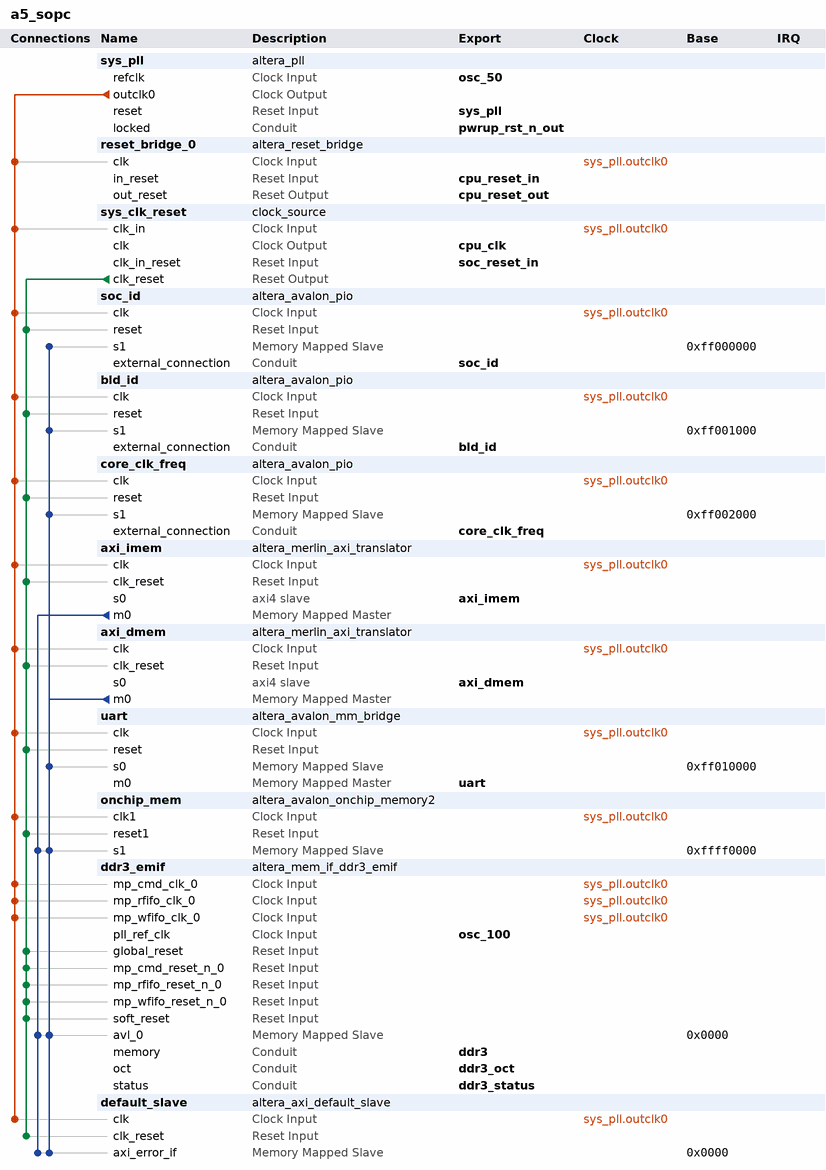
[diagram p0: system contents]
# Platform Designer (Qsys) system a5_sopc, Arria V 5AGXFB3H4F35C4
# Parameters at their usual value, and those the tool derives, are not listed.
package require -exact qsys 13.0
create_system a5_sopc
set_project_property DEVICE_FAMILY {Arria V}
set_project_property DEVICE 5AGXFB3H4F35C4

add_instance sys_pll altera_pll 13.0
set_instance_parameter_value sys_pll gui_device_speed_grade 3_H4
set_instance_parameter_value sys_pll gui_pll_mode {Integer-N PLL}
set_instance_parameter_value sys_pll gui_reference_clock_frequency 50.0
set_instance_parameter_value sys_pll gui_operation_mode normal
set_instance_parameter_value sys_pll gui_use_locked true
set_instance_parameter_value sys_pll gui_number_of_clocks 1
set_instance_parameter_value sys_pll gui_output_clock_frequency0 30.0

add_instance reset_bridge_0 altera_reset_bridge 13.0
set_instance_parameter_value reset_bridge_0 ACTIVE_LOW_RESET 1
set_instance_parameter_value reset_bridge_0 SYNCHRONOUS_EDGES deassert

add_instance sys_clk_reset clock_source 13.0
set_instance_parameter_value sys_clk_reset clockFrequency 30000000
set_instance_parameter_value sys_clk_reset resetSynchronousEdges DEASSERT

add_instance soc_id altera_avalon_pio 13.0.1.99.2
set_instance_parameter_value soc_id direction Input
set_instance_parameter_value soc_id width 32

add_instance bld_id altera_avalon_pio 13.0.1.99.2
set_instance_parameter_value bld_id direction Input
set_instance_parameter_value bld_id width 32

add_instance core_clk_freq altera_avalon_pio 13.0.1.99.2
set_instance_parameter_value core_clk_freq direction Input
set_instance_parameter_value core_clk_freq width 32

add_instance axi_imem altera_merlin_axi_translator 1.0
set_instance_parameter_value axi_imem USE_S0_AWID 1
set_instance_parameter_value axi_imem USE_S0_AWREGION 0
set_instance_parameter_value axi_imem USE_M0_AWREGION 0
set_instance_parameter_value axi_imem USE_S0_AWLEN 1
set_instance_parameter_value axi_imem USE_S0_AWSIZE 1
set_instance_parameter_value axi_imem USE_S0_AWBURST 1
set_instance_parameter_value axi_imem USE_S0_AWLOCK 0
set_instance_parameter_value axi_imem USE_M0_AWLOCK 0
set_instance_parameter_value axi_imem USE_S0_AWCACHE 0
set_instance_parameter_value axi_imem USE_M0_AWCACHE 0
set_instance_parameter_value axi_imem USE_M0_AWPROT 1
set_instance_parameter_value axi_imem USE_S0_AWQOS 0
set_instance_parameter_value axi_imem USE_M0_AWQOS 0
set_instance_parameter_value axi_imem USE_S0_WSTRB 1
set_instance_parameter_value axi_imem USE_M0_WLAST 1
set_instance_parameter_value axi_imem USE_S0_BID 1
set_instance_parameter_value axi_imem USE_S0_BRESP 1
set_instance_parameter_value axi_imem USE_M0_BRESP 1
set_instance_parameter_value axi_imem USE_S0_ARID 1
set_instance_parameter_value axi_imem USE_S0_ARREGION 0
set_instance_parameter_value axi_imem USE_M0_ARREGION 0
set_instance_parameter_value axi_imem USE_S0_ARLEN 1
set_instance_parameter_value axi_imem USE_S0_ARSIZE 1
set_instance_parameter_value axi_imem USE_S0_ARBURST 1
set_instance_parameter_value axi_imem USE_S0_ARLOCK 0
set_instance_parameter_value axi_imem USE_M0_ARLOCK 0
set_instance_parameter_value axi_imem USE_M0_ARCACHE 0
set_instance_parameter_value axi_imem USE_M0_ARQOS 0
set_instance_parameter_value axi_imem USE_M0_ARPROT 1
set_instance_parameter_value axi_imem USE_S0_ARCACHE 0
set_instance_parameter_value axi_imem USE_S0_ARQOS 0
set_instance_parameter_value axi_imem USE_S0_RID 1
set_instance_parameter_value axi_imem USE_S0_RRESP 1
set_instance_parameter_value axi_imem USE_M0_RRESP 1
set_instance_parameter_value axi_imem USE_S0_RLAST 1
set_instance_parameter_value axi_imem M0_ID_WIDTH 4
set_instance_parameter_value axi_imem DATA_WIDTH 32
set_instance_parameter_value axi_imem S0_ID_WIDTH 4
set_instance_parameter_value axi_imem M0_ADDR_WIDTH 32
set_instance_parameter_value axi_imem S0_WRITE_ADDR_USER_WIDTH 4
set_instance_parameter_value axi_imem S0_READ_ADDR_USER_WIDTH 4
set_instance_parameter_value axi_imem M0_WRITE_ADDR_USER_WIDTH 4
set_instance_parameter_value axi_imem M0_READ_ADDR_USER_WIDTH 4
set_instance_parameter_value axi_imem S0_WRITE_DATA_USER_WIDTH 4
set_instance_parameter_value axi_imem S0_WRITE_RESPONSE_DATA_USER_WIDTH 4
set_instance_parameter_value axi_imem S0_READ_DATA_USER_WIDTH 4
set_instance_parameter_value axi_imem M0_WRITE_DATA_USER_WIDTH 4
set_instance_parameter_value axi_imem M0_WRITE_RESPONSE_DATA_USER_WIDTH 4
set_instance_parameter_value axi_imem M0_READ_DATA_USER_WIDTH 4
set_instance_parameter_value axi_imem S0_ADDR_WIDTH 32
set_instance_parameter_value axi_imem USE_S0_AWUSER 0
set_instance_parameter_value axi_imem USE_S0_ARUSER 0
set_instance_parameter_value axi_imem USE_S0_WUSER 0
set_instance_parameter_value axi_imem USE_S0_RUSER 0
set_instance_parameter_value axi_imem USE_S0_BUSER 0
set_instance_parameter_value axi_imem USE_M0_AWUSER 0
set_instance_parameter_value axi_imem USE_M0_ARUSER 0
set_instance_parameter_value axi_imem USE_M0_WUSER 0
set_instance_parameter_value axi_imem USE_M0_RUSER 0
set_instance_parameter_value axi_imem USE_M0_BUSER 0
set_instance_parameter_value axi_imem M0_AXI_VERSION AXI4
set_instance_parameter_value axi_imem S0_AXI_VERSION AXI4
set_instance_parameter_value axi_imem WRITE_ISSUING_CAPABILITY 16
set_instance_parameter_value axi_imem READ_ISSUING_CAPABILITY 16
set_instance_parameter_value axi_imem COMBINED_ISSUING_CAPABILITY 16
set_instance_parameter_value axi_imem WRITE_ACCEPTANCE_CAPABILITY 16
set_instance_parameter_value axi_imem READ_ACCEPTANCE_CAPABILITY 16
set_instance_parameter_value axi_imem COMBINED_ACCEPTANCE_CAPABILITY 16
set_instance_parameter_value axi_imem READ_DATA_REORDERING_DEPTH 1

add_instance axi_dmem altera_merlin_axi_translator 1.0
set_instance_parameter_value axi_dmem USE_S0_AWID 1
set_instance_parameter_value axi_dmem USE_S0_AWREGION 0
set_instance_parameter_value axi_dmem USE_M0_AWREGION 0
set_instance_parameter_value axi_dmem USE_S0_AWLEN 1
set_instance_parameter_value axi_dmem USE_S0_AWSIZE 1
set_instance_parameter_value axi_dmem USE_S0_AWBURST 1
set_instance_parameter_value axi_dmem USE_S0_AWLOCK 0
set_instance_parameter_value axi_dmem USE_M0_AWLOCK 0
set_instance_parameter_value axi_dmem USE_S0_AWCACHE 0
set_instance_parameter_value axi_dmem USE_M0_AWCACHE 0
set_instance_parameter_value axi_dmem USE_M0_AWPROT 1
set_instance_parameter_value axi_dmem USE_S0_AWQOS 0
set_instance_parameter_value axi_dmem USE_M0_AWQOS 0
set_instance_parameter_value axi_dmem USE_S0_WSTRB 1
set_instance_parameter_value axi_dmem USE_M0_WLAST 1
set_instance_parameter_value axi_dmem USE_S0_BID 1
set_instance_parameter_value axi_dmem USE_S0_BRESP 1
set_instance_parameter_value axi_dmem USE_M0_BRESP 1
set_instance_parameter_value axi_dmem USE_S0_ARID 1
set_instance_parameter_value axi_dmem USE_S0_ARREGION 0
set_instance_parameter_value axi_dmem USE_M0_ARREGION 0
set_instance_parameter_value axi_dmem USE_S0_ARLEN 1
set_instance_parameter_value axi_dmem USE_S0_ARSIZE 1
set_instance_parameter_value axi_dmem USE_S0_ARBURST 1
set_instance_parameter_value axi_dmem USE_S0_ARLOCK 0
set_instance_parameter_value axi_dmem USE_M0_ARLOCK 0
set_instance_parameter_value axi_dmem USE_M0_ARCACHE 0
set_instance_parameter_value axi_dmem USE_M0_ARQOS 0
set_instance_parameter_value axi_dmem USE_M0_ARPROT 1
set_instance_parameter_value axi_dmem USE_S0_ARCACHE 0
set_instance_parameter_value axi_dmem USE_S0_ARQOS 0
set_instance_parameter_value axi_dmem USE_S0_RID 1
set_instance_parameter_value axi_dmem USE_S0_RRESP 1
set_instance_parameter_value axi_dmem USE_M0_RRESP 1
set_instance_parameter_value axi_dmem USE_S0_RLAST 1
set_instance_parameter_value axi_dmem M0_ID_WIDTH 4
set_instance_parameter_value axi_dmem DATA_WIDTH 32
set_instance_parameter_value axi_dmem S0_ID_WIDTH 4
set_instance_parameter_value axi_dmem M0_ADDR_WIDTH 32
set_instance_parameter_value axi_dmem S0_WRITE_ADDR_USER_WIDTH 4
set_instance_parameter_value axi_dmem S0_READ_ADDR_USER_WIDTH 4
set_instance_parameter_value axi_dmem M0_WRITE_ADDR_USER_WIDTH 4
set_instance_parameter_value axi_dmem M0_READ_ADDR_USER_WIDTH 4
set_instance_parameter_value axi_dmem S0_WRITE_DATA_USER_WIDTH 4
set_instance_parameter_value axi_dmem S0_WRITE_RESPONSE_DATA_USER_WIDTH 4
set_instance_parameter_value axi_dmem S0_READ_DATA_USER_WIDTH 4
set_instance_parameter_value axi_dmem M0_WRITE_DATA_USER_WIDTH 4
set_instance_parameter_value axi_dmem M0_WRITE_RESPONSE_DATA_USER_WIDTH 4
set_instance_parameter_value axi_dmem M0_READ_DATA_USER_WIDTH 4
set_instance_parameter_value axi_dmem S0_ADDR_WIDTH 32
set_instance_parameter_value axi_dmem USE_S0_AWUSER 0
set_instance_parameter_value axi_dmem USE_S0_ARUSER 0
set_instance_parameter_value axi_dmem USE_S0_WUSER 0
set_instance_parameter_value axi_dmem USE_S0_RUSER 0
set_instance_parameter_value axi_dmem USE_S0_BUSER 0
set_instance_parameter_value axi_dmem USE_M0_AWUSER 0
set_instance_parameter_value axi_dmem USE_M0_ARUSER 0
set_instance_parameter_value axi_dmem USE_M0_WUSER 0
set_instance_parameter_value axi_dmem USE_M0_RUSER 0
set_instance_parameter_value axi_dmem USE_M0_BUSER 0
set_instance_parameter_value axi_dmem M0_AXI_VERSION AXI4
set_instance_parameter_value axi_dmem S0_AXI_VERSION AXI4
set_instance_parameter_value axi_dmem WRITE_ISSUING_CAPABILITY 16
set_instance_parameter_value axi_dmem READ_ISSUING_CAPABILITY 16
set_instance_parameter_value axi_dmem COMBINED_ISSUING_CAPABILITY 16
set_instance_parameter_value axi_dmem WRITE_ACCEPTANCE_CAPABILITY 16
set_instance_parameter_value axi_dmem READ_ACCEPTANCE_CAPABILITY 16
set_instance_parameter_value axi_dmem COMBINED_ACCEPTANCE_CAPABILITY 16
set_instance_parameter_value axi_dmem READ_DATA_REORDERING_DEPTH 1

add_instance uart altera_avalon_mm_bridge 13.0
set_instance_parameter_value uart DATA_WIDTH 32
set_instance_parameter_value uart ADDRESS_WIDTH 5
set_instance_parameter_value uart ADDRESS_UNITS SYMBOLS
set_instance_parameter_value uart MAX_PENDING_RESPONSES 1
set_instance_parameter_value uart PIPELINE_COMMAND 0
set_instance_parameter_value uart PIPELINE_RESPONSE 0

add_instance onchip_mem altera_avalon_onchip_memory2 13.0.1.99.1
set_instance_parameter_value onchip_mem dataWidth 64
set_instance_parameter_value onchip_mem dualPort false
set_instance_parameter_value onchip_mem initMemContent true
set_instance_parameter_value onchip_mem initializationFileName scbl
set_instance_parameter_value onchip_mem instanceID 0
set_instance_parameter_value onchip_mem memorySize 65536
set_instance_parameter_value onchip_mem useNonDefaultInitFile true

add_instance ddr3_emif altera_mem_if_ddr3_emif 13.0
set_instance_parameter_value ddr3_emif MEM_VENDOR Micron
set_instance_parameter_value ddr3_emif MEM_FORMAT DISCRETE
set_instance_parameter_value ddr3_emif MEM_CLK_FREQ_MAX 666.667
set_instance_parameter_value ddr3_emif MEM_ROW_ADDR_WIDTH 13
set_instance_parameter_value ddr3_emif MEM_COL_ADDR_WIDTH 10
set_instance_parameter_value ddr3_emif MEM_DQ_WIDTH 32
set_instance_parameter_value ddr3_emif MEM_BANKADDR_WIDTH 3
set_instance_parameter_value ddr3_emif MEM_DRV_STR RZQ/6
set_instance_parameter_value ddr3_emif MEM_RTT_NOM RZQ/4
set_instance_parameter_value ddr3_emif MEM_RTT_WR {Dynamic ODT off}
set_instance_parameter_value ddr3_emif MEM_WTCL 6
set_instance_parameter_value ddr3_emif MEM_TCL 7
set_instance_parameter_value ddr3_emif TIMING_TIS 190
set_instance_parameter_value ddr3_emif TIMING_TIH 140
set_instance_parameter_value ddr3_emif TIMING_TDS 30
set_instance_parameter_value ddr3_emif TIMING_TDH 65
set_instance_parameter_value ddr3_emif TIMING_TDQSQ 125
set_instance_parameter_value ddr3_emif TIMING_TDQSCK 255
set_instance_parameter_value ddr3_emif TIMING_TDQSS 0.25
set_instance_parameter_value ddr3_emif TIMING_TQSH 0.4
set_instance_parameter_value ddr3_emif TIMING_TDSH 0.2
set_instance_parameter_value ddr3_emif TIMING_TDSS 0.2
set_instance_parameter_value ddr3_emif MEM_TRAS_NS 36.0
set_instance_parameter_value ddr3_emif MEM_TRCD_NS 13.5
set_instance_parameter_value ddr3_emif MEM_TRP_NS 13.5
set_instance_parameter_value ddr3_emif MEM_TRFC_NS 110.0
set_instance_parameter_value ddr3_emif MEM_TWTR 4
set_instance_parameter_value ddr3_emif MEM_TFAW_NS 45.0
set_instance_parameter_value ddr3_emif MEM_TRRD_NS 7.5
set_instance_parameter_value ddr3_emif MEM_TRTP_NS 7.5
set_instance_parameter_value ddr3_emif RATE Full
set_instance_parameter_value ddr3_emif MEM_CLK_FREQ 500.0
set_instance_parameter_value ddr3_emif SPEED_GRADE 4
set_instance_parameter_value ddr3_emif HARD_EMIF true
set_instance_parameter_value ddr3_emif POWER_OF_TWO_BUS true
set_instance_parameter_value ddr3_emif AVL_MAX_SIZE 8
set_instance_parameter_value ddr3_emif PRIORITY_PORT 1,1,1,1,1,1
set_instance_parameter_value ddr3_emif CPORT_TYPE_PORT Bidirectional,Bidirectional,Bidirectional,Bidirectional,Bidirectional,Bidirectional
set_instance_parameter_value ddr3_emif REF_CLK_FREQ 100.0
set_instance_parameter_value ddr3_emif DEFAULT_FAST_SIM_MODEL true
set_instance_parameter_value ddr3_emif EXPORT_AFI_HALF_CLK false
set_instance_parameter_value ddr3_emif PLL_LOCATION Top_Bottom
set_instance_parameter_value ddr3_emif CALIBRATION_MODE Full
set_instance_parameter_value ddr3_emif USER_DEBUG_LEVEL 0
set_instance_parameter_value ddr3_emif TIMING_BOARD_DERATE_METHOD SLEW_RATE
set_instance_parameter_value ddr3_emif TIMING_BOARD_MAX_CK_DELAY 0.42
set_instance_parameter_value ddr3_emif TIMING_BOARD_MAX_DQS_DELAY 0.437
set_instance_parameter_value ddr3_emif TIMING_BOARD_SKEW_CKDQS_DIMM_MIN 0.0039
set_instance_parameter_value ddr3_emif TIMING_BOARD_SKEW_CKDQS_DIMM_MAX 0.012
set_instance_parameter_value ddr3_emif TIMING_BOARD_SKEW_WITHIN_DQS 0.011
set_instance_parameter_value ddr3_emif TIMING_BOARD_SKEW_BETWEEN_DQS 0.029
set_instance_parameter_value ddr3_emif TIMING_BOARD_DQ_TO_DQS_SKEW -0.0040
set_instance_parameter_value ddr3_emif TIMING_BOARD_AC_SKEW 0.0039
set_instance_parameter_value ddr3_emif TIMING_BOARD_AC_TO_CK_SKEW -0.0010

add_instance default_slave altera_axi_default_slave 13.0
set_instance_parameter_value default_slave AXI_ID_W 8
set_instance_parameter_value default_slave AXI_ADDR_W 32
set_instance_parameter_value default_slave AXI_DATA_W 32
set_instance_parameter_value default_slave SUPPORT_CSR 0
set_instance_parameter_value default_slave LOG_CSR_DEPTH 1
set_instance_parameter_value default_slave DEBUGACCESS_SUPPORT 0

# connections
add_connection sys_pll.outclk0 axi_dmem.clk clock
add_connection sys_pll.outclk0 axi_imem.clk clock
add_connection sys_pll.outclk0 bld_id.clk clock
add_connection sys_pll.outclk0 core_clk_freq.clk clock
add_connection sys_pll.outclk0 ddr3_emif.mp_cmd_clk_0 clock
add_connection sys_pll.outclk0 ddr3_emif.mp_rfifo_clk_0 clock
add_connection sys_pll.outclk0 ddr3_emif.mp_wfifo_clk_0 clock
add_connection sys_pll.outclk0 default_slave.clk clock
add_connection sys_pll.outclk0 onchip_mem.clk1 clock
add_connection sys_pll.outclk0 reset_bridge_0.clk clock
add_connection sys_pll.outclk0 soc_id.clk clock
add_connection sys_pll.outclk0 sys_clk_reset.clk_in clock
add_connection sys_pll.outclk0 uart.clk clock
add_connection sys_clk_reset.clk_reset axi_dmem.clk_reset reset
add_connection sys_clk_reset.clk_reset axi_imem.clk_reset reset
add_connection sys_clk_reset.clk_reset bld_id.reset reset
add_connection sys_clk_reset.clk_reset core_clk_freq.reset reset
add_connection sys_clk_reset.clk_reset ddr3_emif.global_reset reset
add_connection sys_clk_reset.clk_reset ddr3_emif.mp_cmd_reset_n_0 reset
add_connection sys_clk_reset.clk_reset ddr3_emif.mp_rfifo_reset_n_0 reset
add_connection sys_clk_reset.clk_reset ddr3_emif.mp_wfifo_reset_n_0 reset
add_connection sys_clk_reset.clk_reset ddr3_emif.soft_reset reset
add_connection sys_clk_reset.clk_reset default_slave.clk_reset reset
add_connection sys_clk_reset.clk_reset onchip_mem.reset1 reset
add_connection sys_clk_reset.clk_reset soc_id.reset reset
add_connection sys_clk_reset.clk_reset uart.reset reset
add_connection axi_dmem.m0 bld_id.s1 avalon
set_connection_parameter_value axi_dmem.m0/bld_id.s1 baseAddress 0xff001000
add_connection axi_dmem.m0 core_clk_freq.s1 avalon
set_connection_parameter_value axi_dmem.m0/core_clk_freq.s1 baseAddress 0xff002000
add_connection axi_dmem.m0 ddr3_emif.avl_0 avalon
set_connection_parameter_value axi_dmem.m0/ddr3_emif.avl_0 baseAddress 0x0000
add_connection axi_dmem.m0 default_slave.axi_error_if avalon
set_connection_parameter_value axi_dmem.m0/default_slave.axi_error_if baseAddress 0x0000
set_connection_parameter_value axi_dmem.m0/default_slave.axi_error_if defaultConnection true
add_connection axi_dmem.m0 onchip_mem.s1 avalon
set_connection_parameter_value axi_dmem.m0/onchip_mem.s1 baseAddress 0xffff0000
add_connection axi_dmem.m0 soc_id.s1 avalon
set_connection_parameter_value axi_dmem.m0/soc_id.s1 baseAddress 0xff000000
add_connection axi_dmem.m0 uart.s0 avalon
set_connection_parameter_value axi_dmem.m0/uart.s0 baseAddress 0xff010000
add_connection axi_imem.m0 ddr3_emif.avl_0 avalon
set_connection_parameter_value axi_imem.m0/ddr3_emif.avl_0 baseAddress 0x0000
add_connection axi_imem.m0 default_slave.axi_error_if avalon
set_connection_parameter_value axi_imem.m0/default_slave.axi_error_if baseAddress 0x0000
set_connection_parameter_value axi_imem.m0/default_slave.axi_error_if defaultConnection true
add_connection axi_imem.m0 onchip_mem.s1 avalon
set_connection_parameter_value axi_imem.m0/onchip_mem.s1 baseAddress 0xffff0000

# exported interfaces
add_interface ddr3 conduit end
set_interface_property ddr3 EXPORT_OF ddr3_emif.memory
add_interface ddr3_oct conduit end
set_interface_property ddr3_oct EXPORT_OF ddr3_emif.oct
add_interface axi_imem axi4 slave
set_interface_property axi_imem EXPORT_OF axi_imem.s0
add_interface axi_dmem axi4 slave
set_interface_property axi_dmem EXPORT_OF axi_dmem.s0
add_interface bld_id conduit end
set_interface_property bld_id EXPORT_OF bld_id.external_connection
add_interface osc_100 clock sink
set_interface_property osc_100 EXPORT_OF ddr3_emif.pll_ref_clk
add_interface uart avalon master
set_interface_property uart EXPORT_OF uart.m0
add_interface soc_id conduit end
set_interface_property soc_id EXPORT_OF soc_id.external_connection
add_interface core_clk_freq conduit end
set_interface_property core_clk_freq EXPORT_OF core_clk_freq.external_connection
add_interface osc_50 clock sink
set_interface_property osc_50 EXPORT_OF sys_pll.refclk
add_interface sys_pll reset sink
set_interface_property sys_pll EXPORT_OF sys_pll.reset
add_interface ddr3_status conduit end
set_interface_property ddr3_status EXPORT_OF ddr3_emif.status
add_interface cpu_clk clock source
set_interface_property cpu_clk EXPORT_OF sys_clk_reset.clk
add_interface soc_reset_in reset sink
set_interface_property soc_reset_in EXPORT_OF sys_clk_reset.clk_in_reset
add_interface cpu_reset_in reset sink
set_interface_property cpu_reset_in EXPORT_OF reset_bridge_0.in_reset
add_interface cpu_reset_out reset source
set_interface_property cpu_reset_out EXPORT_OF reset_bridge_0.out_reset
add_interface pwrup_rst_n_out conduit end
set_interface_property pwrup_rst_n_out EXPORT_OF sys_pll.locked

set_interconnect_requirement {$system} qsys_mm.clockCrossingAdapter AUTO
set_interconnect_requirement {$system} qsys_mm.maxAdditionalLatency 2

save_system a5_sopc.qsys
